# Altium schematic sheet ADC_Subsystem.SchDoc
size A; SheetNumber: 7; SheetTotal: 16
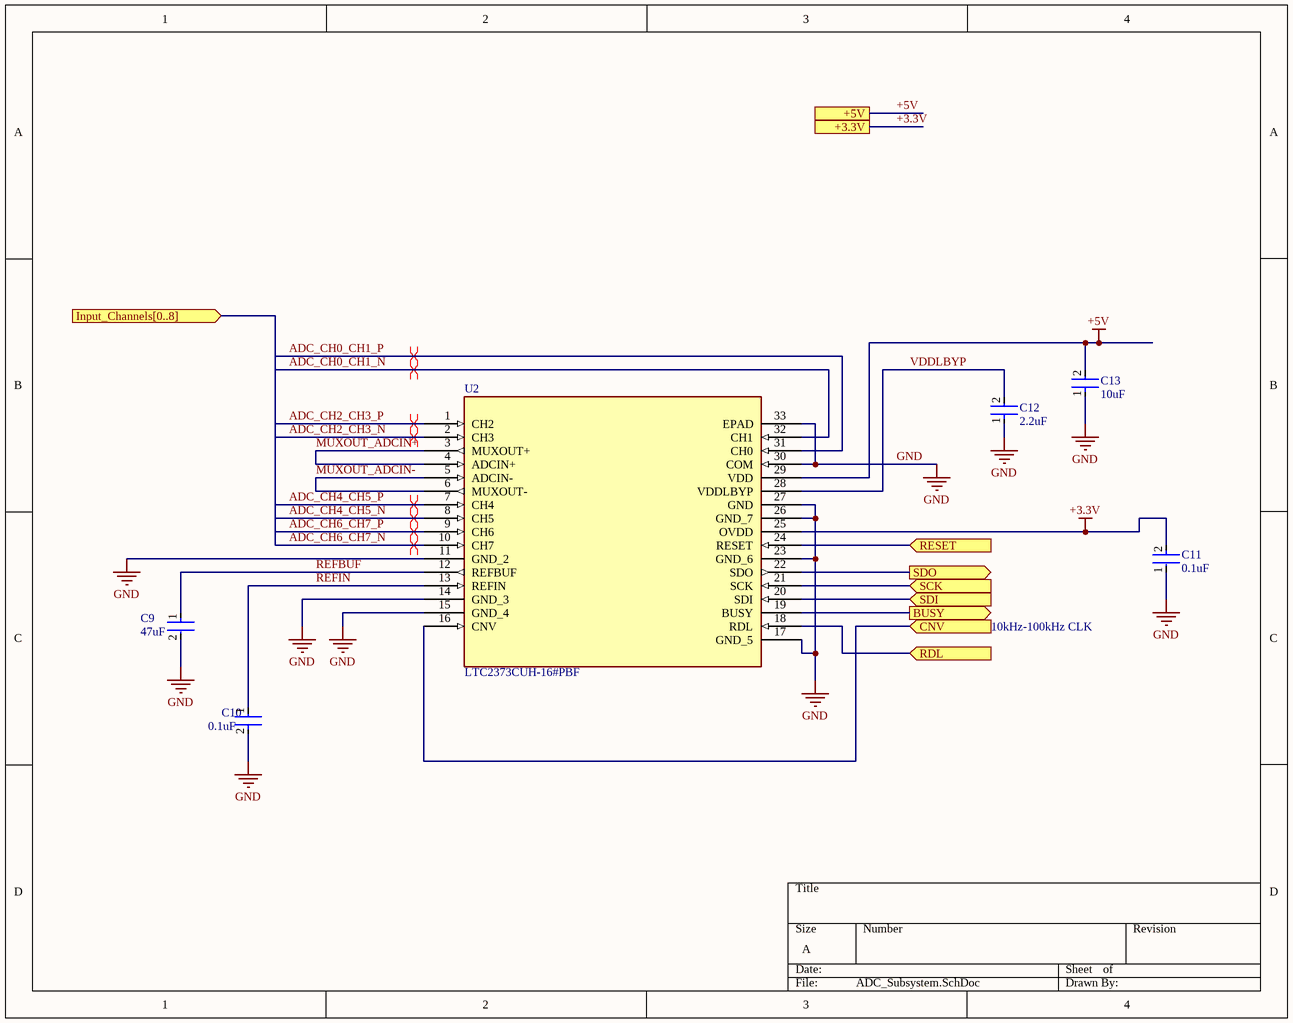
[diagram p0: ADC_Subsystem.SchDoc]

## Parts
C9  47uF  [FP-C0805C476M9PACTU-MFG]
C10  0.1uF  [FP-GRM15-MFG]
C11  0.1uF  [FP-GRM15-MFG]
C12  2.2uF  [FP-GRM188-0_1-e0_2_0_5-MFG]
C13  10uF  [FP-GRM188-0_1-e0_2_0_55-IPC_A]
U2  LTC2373CUH-16#PBF  [LTC_2373_Footprint]

## Ports
+3.3V, +5V, BUSY (out), CNV (in), Input_Channels[0..8] (in), RDL (in), RESET (in), SCK (in), SDI (in), SDO (out)

## Nets
+3.3V: C11.2 U2.25(OVDD) ; port +3.3V
+5V: C13.2 U2.29(VDD) ; port +5V
GND: C9.2 C10.2 C11.1 C12.1 C13.1 U2.11(GND_2) U2.14(GND_3) U2.15(GND_4) U2.17(GND_5) U2.23(GND_6) U2.26(GND_7) U2.27(GND) U2.30(COM) U2.33(EPAD)
ADC_CH0_CH1_N: U2.32(CH1)
ADC_CH0_CH1_P: U2.31(CH0)
ADC_CH2_CH3_N: U2.2(CH3)
ADC_CH2_CH3_P: U2.1(CH2)
ADC_CH4_CH5_N: U2.8(CH5)
ADC_CH4_CH5_P: U2.7(CH4)
ADC_CH6_CH7_N: U2.10(CH7)
ADC_CH6_CH7_P: U2.9(CH6)
BUSY: U2.19(BUSY) ; port BUSY
CNV: U2.16(CNV) ; port CNV
MUXOUT_ADCIN+: U2.3(MUXOUT+) U2.4(ADCIN+)
MUXOUT_ADCIN-: U2.5(ADCIN-) U2.6(MUXOUT-)
RDL: U2.18(RDL) ; port RDL
REFBUF: C9.1 U2.12(REFBUF)
REFIN: C10.1 U2.13(REFIN)
RESET: U2.24(RESET) ; port RESET
SCK: U2.21(SCK) ; port SCK
SDI: U2.20(SDI) ; port SDI
SDO: U2.22(SDO) ; port SDO
VDDLBYP: C12.2 U2.28(VDDLBYP)

## Layout directives
differential pair: ADC_CH0_CH1_N, ADC_CH0_CH1_P, ADC_CH2_CH3_N, ADC_CH2_CH3_P, ADC_CH4_CH5_N, ADC_CH4_CH5_P, ADC_CH6_CH7_N, ADC_CH6_CH7_P

## Notes on the sheet
- 10kHz-100kHz CLK

## Library data of the parts
C9 = CMP-2007-01008-2: CAP CER 47UF 6.3V X5R 0805 / C0805C476M9PACTU; Dielectric Material: Ceramic; Dissipation Factor: 5%; Tolerance: 20%; Case Code (Imperial): 0805; Mount: PCB; Width: 1.2mm; Package Quantity: 3000; Radiation Hardening: No; Packaging: Tape and Reel; Termination: SMD/SMT; Series: C0805C; Voltage: 6.3V; Depth: 1.25mm; Dielectric: X5R; Case Code (Metric): 2012; Length: 2mm; Case/Package: 0805; REACH SVHC: No SVHC; Voltage Rating (DC): 6.3V; Capacitance: 47uF; RoHS Compliant: Yes; Height: 1.25mm; Construction: Flat; Number of Pins: 2; Voltage Rating: 6.3V; Max Operating Temperature: 85°C; Min Operating Temperature: -55°C
C10 C11 = CMP-2100-03641-2: CAP CER 0.1UF 16V X7R 0402 / GRM155R71C104KA88D; Manufacturer: Murata; Standoff Height: 0mm; Tolerance: 10%; Voltage Rating: 16Vdc; Material: Ceramic; Capacitance: 0.10μF; Value: 0.10μF; RoHS: TRUE; Manufacturer Part Number: GRM155R71C104KA88D; Temperature Characteristic: X7R; Octopart: https://octopart.com/grm155r71c104ka88d-murata-196880; Digikey Description: CAP CER 0.1UF 16V X7R 0402; Device Class L3: Ceramic Capacitors; Height: 0.55mm; ComponentLink2Description: Datasheet; Temperature Range Low: -55°C; Ipc Land Pattern Name: CAPC10050X219; ComponentLink2URL: https://search.murata.co.jp/Ceramy/image/img/A01X/G101/ENG/GRM155R71H471KA01-01A.pdf; Device Class L1: Passive Components; Lead Free: yes; Category: Cap; Package: GRM15; Temperature: -55°C to +125°C; Device Class L2: Capacitors; Temperature Range High: +125°C; Mouser Description: 0402 0.1 uF 16V ±10 % Tolerance X7R SMT Multilayer Ceramic Capacitor
C12 = CMP-2006-02836-2: Chip Multilayer Ceramic Capacitors for General Purpose, 0603, 2.2uF, X7R, 15%, 10%, 10V / GRM188R71A225KE15D; Case Code (Metric): 1608; Height: 0.8mm; Packaging: Cut Tape; Voltage: 10V; Lead Free: Lead Free; Min Operating Temperature: -55°C; Voltage Rating (DC): 10V; Max Operating Temperature: 125°C; Voltage Rating: 10V; Dielectric: X7R; Depth: 0.8mm; Case Code (Imperial): 0603; Termination: SMD/SMT; Case/Package: 0603; Number of Pins: 2; REACH SVHC: No SVHC; Mount: Surface Mount; Width: 0.031inch; Material: Ceramic; Capacitance: 2.2uF; Package Quantity: 1; Weight: 7.1E-05oz; Length: 1.6mm; Thickness: 0.035inch; Tolerance: 10%
C13 = CMP-2006-02792-2: Chip Multilayer Ceramic Capacitors for General Purpose, 0603, 10uF, X5R, 15%, 20%, 6.3V / GRM188R60J106ME47D; Packaging: Tape and Reel; Voltage Rating (DC): 6.3V; Width: 0.031inch; Termination: SMD/SMT; Dielectric: X5R; Package Quantity: 4000; Voltage Rating: 6.3V; Capacitance: 10uF; Case/Package: 0603; Min Operating Temperature: -55°C; Voltage: 6.3V; Length: 1.6mm; Thickness: 0.035inch; Lead Free: Lead Free; Depth: 0.8mm; Case Code (Imperial): 0603; Max Operating Temperature: 85°C; Material: Ceramic; Height: 0.8mm; Tolerance: 20%; Mount: Surface Mount; REACH SVHC: No SVHC; Radiation Hardening: No; Case Code (Metric): 1608